# Altium project Arduino_Catfeeder.PrjPcb
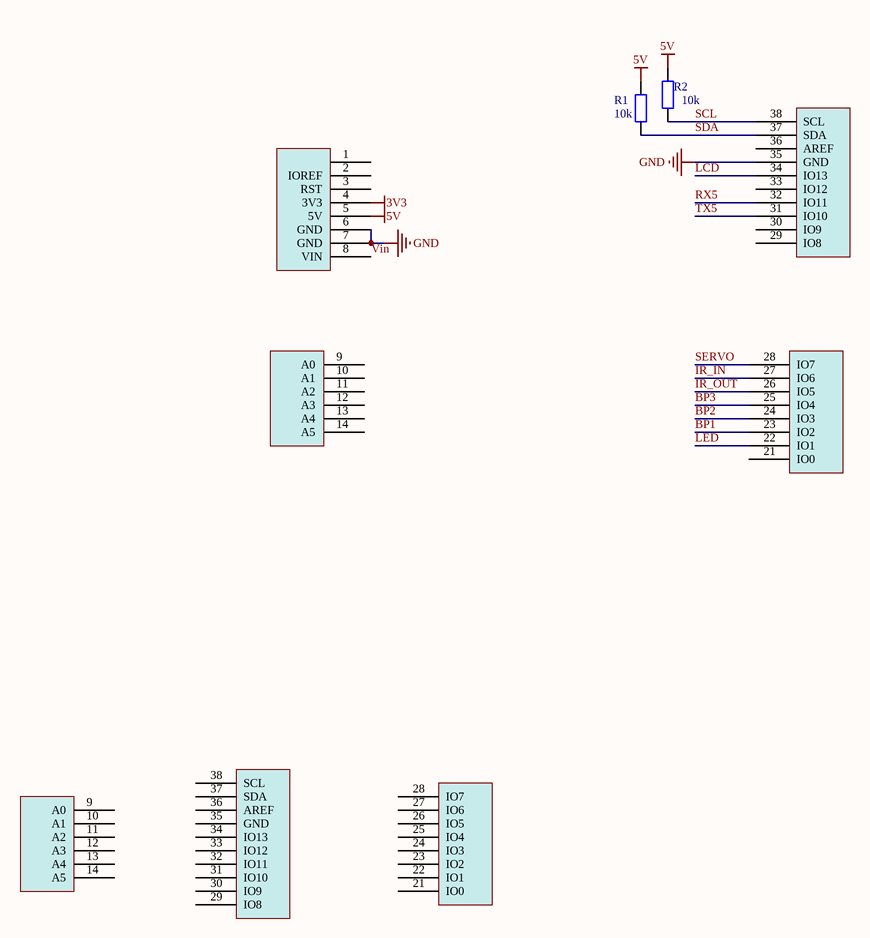
[diagram p0: ArduinoUnoShield.SchDoc]
Version: v2; PCBName: Shield Catfeeder UNO; Designator: 0000000; BOMRevision: 0
6 sheets, 38 parts. Net scope: global (net labels, ports and power ports of the same name join across sheets).
Board file: ArduinoUnoShield.PcbDoc
Sheets:
  ArduinoUnoShield.SchDoc
  Motor.SchDoc
  Wireless.SchDoc
  Display.SchDoc
  RTC.SchDoc
  IR.SchDoc

## Sheet ArduinoUnoShield.SchDoc
size A4; Revision: 0

### Parts
P1  UNO4NUCLEO  [UNO4NUCLEO]  (value not drawn)  (parts A,B,C,D of 4)
P1B  UNO4NUCLEO  [UNO4NUCLEO]  (value not drawn)  (part B of 4)
P1C  UNO4NUCLEO  [UNO4NUCLEO]  (value not drawn)  (part D of 4)  (mechanical)
P1D  UNO4NUCLEO  [UNO4NUCLEO]  (value not drawn)  (part C of 4)  (mechanical)
R1  10k  [0805-R]
R2  10k  [0805-R]

### Nets
3V3: P1.4(3V3)
5V: P1.5(5V) R1.1 R2.1
GND: P1.6(GND) P1.7(GND) P1.35(GND)
BP1: P1.23(IO2)
BP2: P1.24(IO3)
BP3: P1.25(IO4)
IR_IN: P1.27(IO6)
IR_OUT: P1.26(IO5)
LCD: P1.34(IO13)
LED: P1.22(IO1)
RX5: P1.32(IO11)
SCL: P1.38(SCL) R2.2
SDA: P1.37(SDA) R1.2
SERVO: P1.28(IO7)
TX5: P1.31(IO10)
Vin: P1.8(VIN)

Not connected (* = marked no-connect by the designer): P1 1(8) 2(IOREF) 3(RST) 9(A0) 10(A1) 11(A2) 12(A3) 13(A4) 14(A5) 21(IO0) 29(IO8) 30(IO9) 33(IO12) 36(AREF); P1B 9(A0) 10(A1) 11(A2) 12(A3) 13(A4) 14(A5); P1C 29(IO8) 30(IO9) 31(IO10) 32(IO11) 33(IO12) 34(IO13) 35(GND) 36(AREF) 37(SDA) 38(SCL); P1D 21(IO0) 22(IO1) 23(IO2) 24(IO3) 25(IO4) 26(IO5) 27(IO6) 28(IO7)

### Notes on the sheet
- Title
- Size:
- Date:
- A4
- Number:
- Time:
- Revision:
- Sheet
- of
- File:

### Library data of the parts
P1 P1B P1C P1D = UNO4NUCLEO: Header mâle, Carte-à-carte, 2.54 mm, 1 Rangée(s), 10 Contact(s), Traversant, droit, Série 2211S; Fabricant: MULTICOMP PRO; Fournisseur: Farnell; RefFabricant: 2211S-10G; RefFournisseur: 1593417; Valeur: 10 cts
R1 R2 = Res: Résistance à puce CMS, 10 kohm, ± 1%, 250 mW, 0805 [2012 Metric], Couche épaisse, Haute puissance; Fabricant: MULTICOMP PRO; Fournisseur: Farnell; RefFabricant: MCWF08P1002FTL; RefFournisseur: 2694096; Voltage: 150V; Revision: July-2002: Re-released for DXP Platform.; Valeur: 10k

## Sheet Motor.SchDoc
size A4; Revision: 0
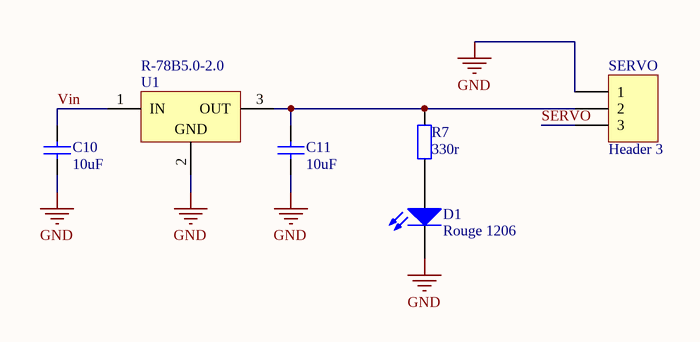
[diagram p1: Motor.SchDoc]

### Parts
C10  10uF  [1206-C]
C11  10uF  [1206-C]
D1  Rouge 1206  [1206-Led-R]
R7  330r  [0805-R]
SERVO  Header 3  [HDR1X3]
U1  R-78B5.0-2.0  [R78HB50V]

### Nets
GND: C10.1 C11.1 D1.1(K) SERVO.1 U1.2(GND)
SERVO: SERVO.3
Vin: C10.2 U1.1(IN)
NetC11_2: C11.2 R7.2 SERVO.2 U1.3(OUT)
NetD1_2: D1.2(A) R7.1

### Notes on the sheet
- Title
- Size:
- Date:
- A4
- Number:
- Time:
- Revision:
- Sheet
- of
- File:

### Library data of the parts
C10 C11 = Cap_np: Condensateur céramique multicouche CMS, 10 µF, 25 V, 1206 [3216 Metric], ± 10%, X5R, Série MC; Fabricant: MULTICOMP PRO; Fournisseur: Farnell; RefFabricant: MC1206X106K250CT; RefFournisseur: 2320887; Voltage: 25V; Valeur: 10uF
D1 = LED CMS 1206 Red: LED, Basse puissance, Rouge, CMS, 1206 (Métrique 3216), 20 mA, 1.85 V, 640 nm; Fabricant: KINGBRIGHT; Fournisseur: Farnell; RefFabricant: KPTD-3216SRC-PRV; RefFournisseur: 2001662; Voltage: 1.85V; Revision: July-2002: Re-released for DXP Platform.; Valeur: Rouge 1206
R7 = Res: Résistance à puce CMS, Couche épaisse, 330 ohm, ± 1%, 125 mW, 0805 [2012 Metric], Couche épaisse; Fabricant: MULTICOMP PRO; Fournisseur: Farnell; RefFabricant: MCWR08X3300FTL; RefFournisseur: 2447638; Voltage: 150V; Valeur: 330r
SERVO = Header 3: Header mâle, Carte-à-carte, 2.54 mm, 1 Rangée(s), 10 Contact(s), Traversant, droit, Série 2211S; Fabricant: MULTICOMP PRO; Fournisseur: Farnell; RefFabricant: 2211S-10G; RefFournisseur: 1593417; Valeur: 10 cts
U1 = R78HB50: Convertisseur DC/DC POL non isolé, 1 sortie, 10 W, 5 V, 2 A, Fixe, Traversant; Fabricant: RECOM POWER; Fournisseur: Farnell; RefFournisseur: 2747528; Voltage: IN 6.5V-32V ; OUT 5V; RefFabricant: R-78B5.0-2.0

## Sheet Wireless.SchDoc
size A4; Revision: 0
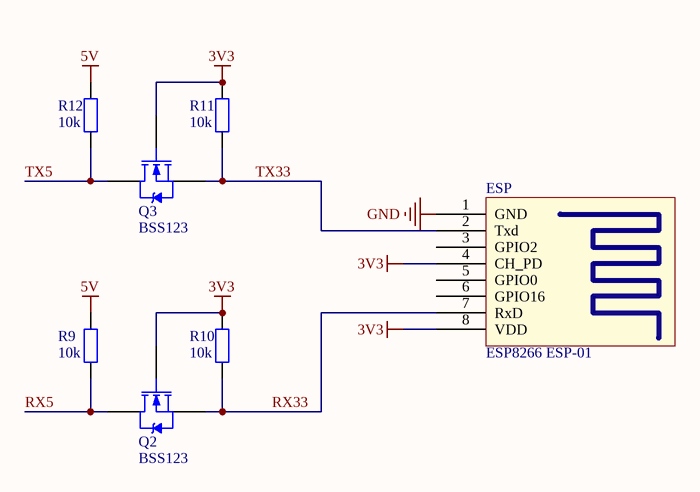
[diagram p2: Wireless.SchDoc]

### Parts
ESP  ESP8266 ESP-01  [ESP8266 ESP-01]
Q2  BSS123  [SOT23-3]
Q3  BSS123  [SOT23-3]
R9  10k  [0805-R]
R10  10k  [0805-R]
R11  10k  [0805-R]
R12  10k  [0805-R]

### Nets
3V3: ESP.4(CH_PD) ESP.8(VDD) Q2.1(G) Q3.1(G) R10.1 R11.1
5V: R9.1 R12.1
GND: ESP.1(GND)
RX5: Q2.3(D) R9.2
RX33: ESP.7(RxD) Q2.2(S) R10.2
TX5: Q3.3(D) R12.2
TX33: ESP.2(Txd) Q3.2(S) R11.2

Not connected (* = marked no-connect by the designer): ESP 3(GPIO2) 5(GPIO0) 6(GPIO16)

### Notes on the sheet
- Title
- Size:
- Date:
- A4
- Number:
- Time:
- Revision:
- Sheet
- of
- File:

### Library data of the parts
ESP = ESP8266 ESP-01: Embase PCB, Carte-à-carte, 2.54 mm, 2 Rangée(s), 8 Contact(s), Montage traversant, Série 2214S; Fabricant: MULTICOMP PRO; Fournisseur: Farnell; RefFabricant: 2214S-08SG-85; RefFournisseur: 1593489; Valeur: 2*4 cts
Q2 Q3 = 2N7000: MOSFET de puissance, Canal N, 100 V, 170 mA, 1.2 ohm, SOT-23, Montage en surface; Fabricant: ON SEMICONDUCTOR; Fournisseur: Farnell; RefFournisseur: 9845321; Voltage: 100V; RefFabricant: BSS123
R9-R12 = Res: as R1 on sheet ArduinoUnoShield; Revision: July-2002: Re-released for DXP Platform.; Valeur: 10k

## Sheet Display.SchDoc
size A4; Revision: 0
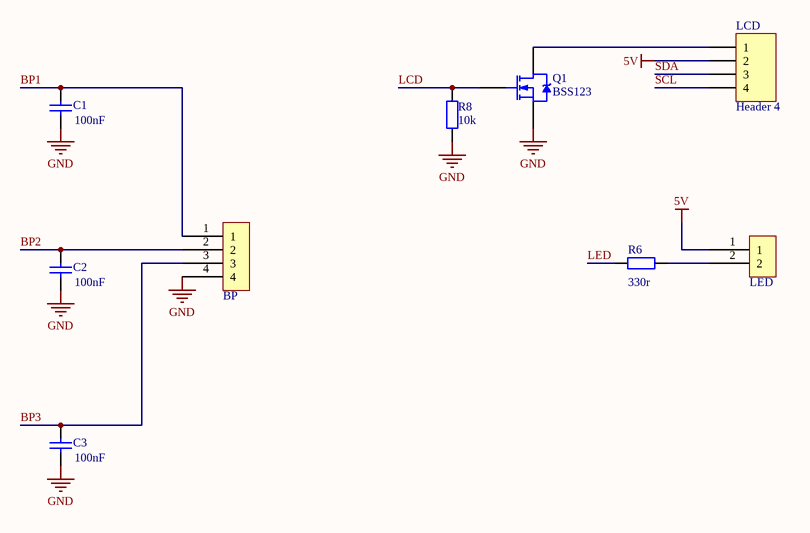
[diagram p3: Display.SchDoc]

### Parts
BP  Bornier_4_vis  [282834-4]  (value not drawn)
C1  100nF  [0805-C]
C2  100nF  [0805-C]
C3  100nF  [0805-C]
LCD  Header 4  [HDR1X4]
LED  Bornier_2_vis  [282834-2]  (value not drawn)
Q1  BSS123  [SOT23-3]
R6  330r  [0805-R]
R8  10k  [0805-R]

### Nets
5V: LCD.2 LED.1
GND: BP.4 C1.1 C2.1 C3.1 Q1.2(S) R8.1
BP1: BP.1 C1.2
BP2: BP.2 C2.2
BP3: BP.3 C3.2
LCD: Q1.1(G) R8.2
LED: R6.1
SCL: LCD.4
SDA: LCD.3
NetLCD_1: LCD.1 Q1.3(D)
NetLED_2: LED.2 R6.2

### Notes on the sheet
- Title
- Size:
- Date:
- A4
- Number:
- Time:
- Revision:
- Sheet
- of
- File:

### Library data of the parts
BP = Bornier_4_vis: Bornier fil-à-carte, 2.54 mm, 4 Voies, 30 AWG, 16 AWG, 1.4 mm², Par vis; Fabricant: TE; Fournisseur: Farnell; RefFournisseur: 2396253; Valeur: 10A - 4voies; Voltage: 150V; RefFabricant: 282834-4
C1-C3 = Cap_np: Condensateur céramique multicouche CMS, 0.1 µF, 50 V, 0805 [2012 Metric], ± 10%, X7R; Fabricant: AVX; Fournisseur: Farnell; RefFabricant: 08055C104KAT2A; RefFournisseur: 499687; Voltage: 50V; Revision: July-2002: Re-released for DXP Platform.; Valeur: 100nF
LCD = Header 4: Header mâle, Carte-à-carte, 2.54 mm, 1 Rangée(s), 10 Contact(s), Traversant, droit, Série 2211S; Fabricant: MULTICOMP PRO; Fournisseur: Farnell; RefFabricant: 2211S-10G; RefFournisseur: 1593417; Valeur: 10 cts
LED = Bornier_2_vis: Bornier fil-à-carte, 2.54 mm, 2 Voies, 30 AWG, 16 AWG, 1.4 mm², Par vis; Fabricant: TE; Fournisseur: Farnell; RefFournisseur: 2112482; Valeur: 10A - 2voies; Voltage: 150V; RefFabricant: 282834-2
Q1 = 2N7000: as Q2 on sheet Wireless; RefFabricant: BSS123
R6 = Res: as R7 on sheet Motor; Revision: July-2002: Re-released for DXP Platform.; Valeur: 330r
R8 = Res: as R1 on sheet ArduinoUnoShield; Valeur: 10k

## Sheet RTC.SchDoc
size A4; Revision: 0
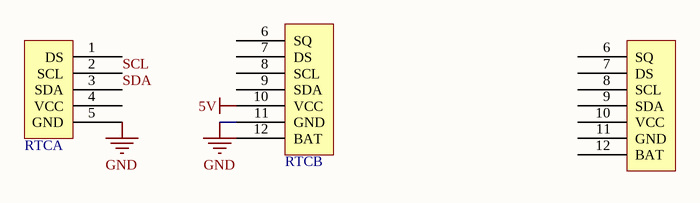
[diagram p4: RTC.SchDoc]

### Parts
RTC  TinyRTC  [Tiny RTC]  (value not drawn)  (parts A,B of 2)
RTCB  TinyRTC  [Tiny RTC]  (value not drawn)  (part B of 2)  (mechanical)

### Nets
5V: RTC.10(VCC)
GND: RTC.5(GND) RTC.11(GND)
SCL: RTC.2(SCL)
SDA: RTC.3(SDA)

Not connected (* = marked no-connect by the designer): RTC 1(DS) 4(VCC) 6(SQ) 7(DS) 8(SCL) 9(SDA) 12(BAT); RTCB 6(SQ) 7(DS) 8(SCL) 9(SDA) 10(VCC) 11(GND) 12(BAT)

### Notes on the sheet
- Title
- Size:
- Date:
- A4
- Number:
- Time:
- Revision:
- Sheet
- of
- File:

### Library data of the parts
RTC = TinyRTC: Embase PCB, Carte-à-carte, 2.54 mm, 1 Rangée(s), 5 Contact(s), Montage traversant, SSW Series; Fabricant: SAMTEC; Fournisseur: Farnell; RefFabricant: SSW-105-01-G-S; RefFournisseur: 2578707; Valeur: 5 cts
RTCB = TinyRTC: Embase PCB, Carte-à-carte, 2.54 mm, 1 Rangée(s), 7 Contact(s), Montage traversant, SSW Series; Fabricant: SAMTEC; Fournisseur: Farnell; RefFabricant: SSW-107-01-G-S; RefFournisseur: 2984569; Valeur: 7 cts

## Sheet IR.SchDoc
size A4; Revision: 0
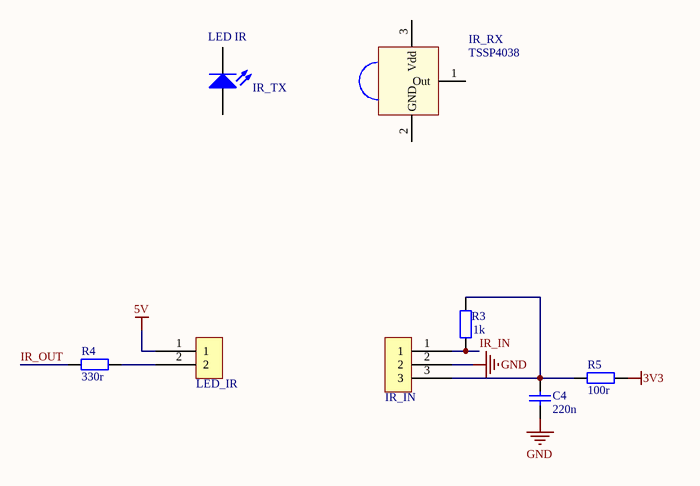
[diagram p5: IR.SchDoc]

### Parts
C4  220n  [0805-C]
IR_IN  Bornier_3_vis  [282834-3]  (value not drawn)
IR_RX  TSSP4038  (mechanical)
IR_TX  LED IR  (mechanical)
LED_IR  Bornier_2_vis  [282834-2]  (value not drawn)
R3  1k  [0805-R]
R4  330r  [0805-R]
R5  100r  [0805-R]

### Nets
3V3: R5.2
5V: LED_IR.1
GND: C4.1 IR_IN.2
IR_IN: IR_IN.1 R3.1
IR_OUT: R4.1
NetC4_2: C4.2 IR_IN.3 R3.2 R5.1
NetLED_IR_2: LED_IR.2 R4.2

Not connected (* = marked no-connect by the designer): IR_RX 1(Out) 2(GND) 3(Vdd); IR_TX 1(K) 2(A)

### Notes on the sheet
- Title
- Size:
- Date:
- A4
- Number:
- Time:
- Revision:
- Sheet
- of
- File:

### Library data of the parts
C4 = Cap_np: Condensateur céramique multicouche CMS, 0.22 µF, 50 V, 0805 [2012 Metric], ± 10%, X7R; Fabricant: WALSIN; Fournisseur: Farnell; RefFabricant: 0805B224K500CT; RefFournisseur: 2496964; Voltage: 50V; Valeur: 220n
IR_IN = Bornier_3_vis: Bornier fil-à-carte, 2.54 mm, 3 Voies, 30 AWG, 16 AWG, 1.4 mm², Par vis; Fabricant: TE; Fournisseur: Farnell; RefFournisseur: 2396254; Valeur: 10A - 3voies; Voltage: 150V; RefFabricant: 282834-3
IR_RX = TSSP93056: Récepteur infrarouge, Barrière lumineuse, 38 kHz, Traversant Vue latérale, 25m, 0.4 mW/m²; Fabricant: Vishay; Fournisseur: Farnell; RefFournisseur: 2251441; RefFabricant: TSSP4038
IR_TX = LED white: Emetteur infrarouge, Haute Puissance, 940 nm, 17 °, T-1 3/4 (5mm), 15 mW/Sr, 15 ns, 15 ns; Fabricant: VISHAY; Fournisseur: Farnell; RefFabricant: TSAL6200; RefFournisseur: 3152856; Valeur: 940nm
LED_IR = Bornier_2_vis: as LED on sheet Display; RefFabricant: 282834-2
R3 = Res: Résistance à puce CMS, Couche épaisse, 1 kohm, ± 1%, 125 mW, 0805 [2012 Metric], Couche épaisse; Fabricant: MULTICOMP PRO; Fournisseur: Farnell; RefFabricant: MCWR08X1001FTL; RefFournisseur: 2447587; Revision: July-2002: Re-released for DXP Platform.; Valeur: 1k
R4 = Res: as R7 on sheet Motor; Revision: July-2002: Re-released for DXP Platform.; Valeur: 330r
R5 = Res: Résistance à puce CMS, 100 ohm, ± 1%, 500 mW, 0805 [2012 Metric], Couche épaisse, Anti-Surtension; Fabricant: Yageo; Fournisseur: Farnell; RefFabricant: SR0805FR-47100RL; RefFournisseur: 3496794; Voltage: 150V; Revision: July-2002: Re-released for DXP Platform.; Valeur: 100r

## Nets that join several sheets
3V3: ArduinoUnoShield (P1.4), Wireless (6 pins), IR (R5.2)
5V: ArduinoUnoShield (P1.5 R1.1 R2.1), Wireless (R9.1 R12.1), Display (LCD.2 LED.1), RTC (RTC.10), IR (LED_IR.1)
GND: ArduinoUnoShield (P1.6 P1.7 P1.35), Motor (5 pins), Wireless (ESP.1), Display (6 pins), RTC (RTC.5 RTC.11), IR (C4.1 IR_IN.2)
BP1: ArduinoUnoShield (P1.23), Display (BP.1 C1.2)
BP2: ArduinoUnoShield (P1.24), Display (BP.2 C2.2)
BP3: ArduinoUnoShield (P1.25), Display (BP.3 C3.2)
IR_IN: ArduinoUnoShield (P1.27), IR (IR_IN.1 R3.1)
IR_OUT: ArduinoUnoShield (P1.26), IR (R4.1)
LCD: ArduinoUnoShield (P1.34), Display (Q1.1 R8.2)
LED: ArduinoUnoShield (P1.22), Display (R6.1)
RX5: ArduinoUnoShield (P1.32), Wireless (Q2.3 R9.2)
SCL: ArduinoUnoShield (P1.38 R2.2), Display (LCD.4), RTC (RTC.2)
SDA: ArduinoUnoShield (P1.37 R1.2), Display (LCD.3), RTC (RTC.3)
SERVO: ArduinoUnoShield (P1.28), Motor (SERVO.3)
TX5: ArduinoUnoShield (P1.31), Wireless (Q3.3 R12.2)
Vin: ArduinoUnoShield (P1.8), Motor (C10.2 U1.1)